# Altium project Proyecto.PrjPCB
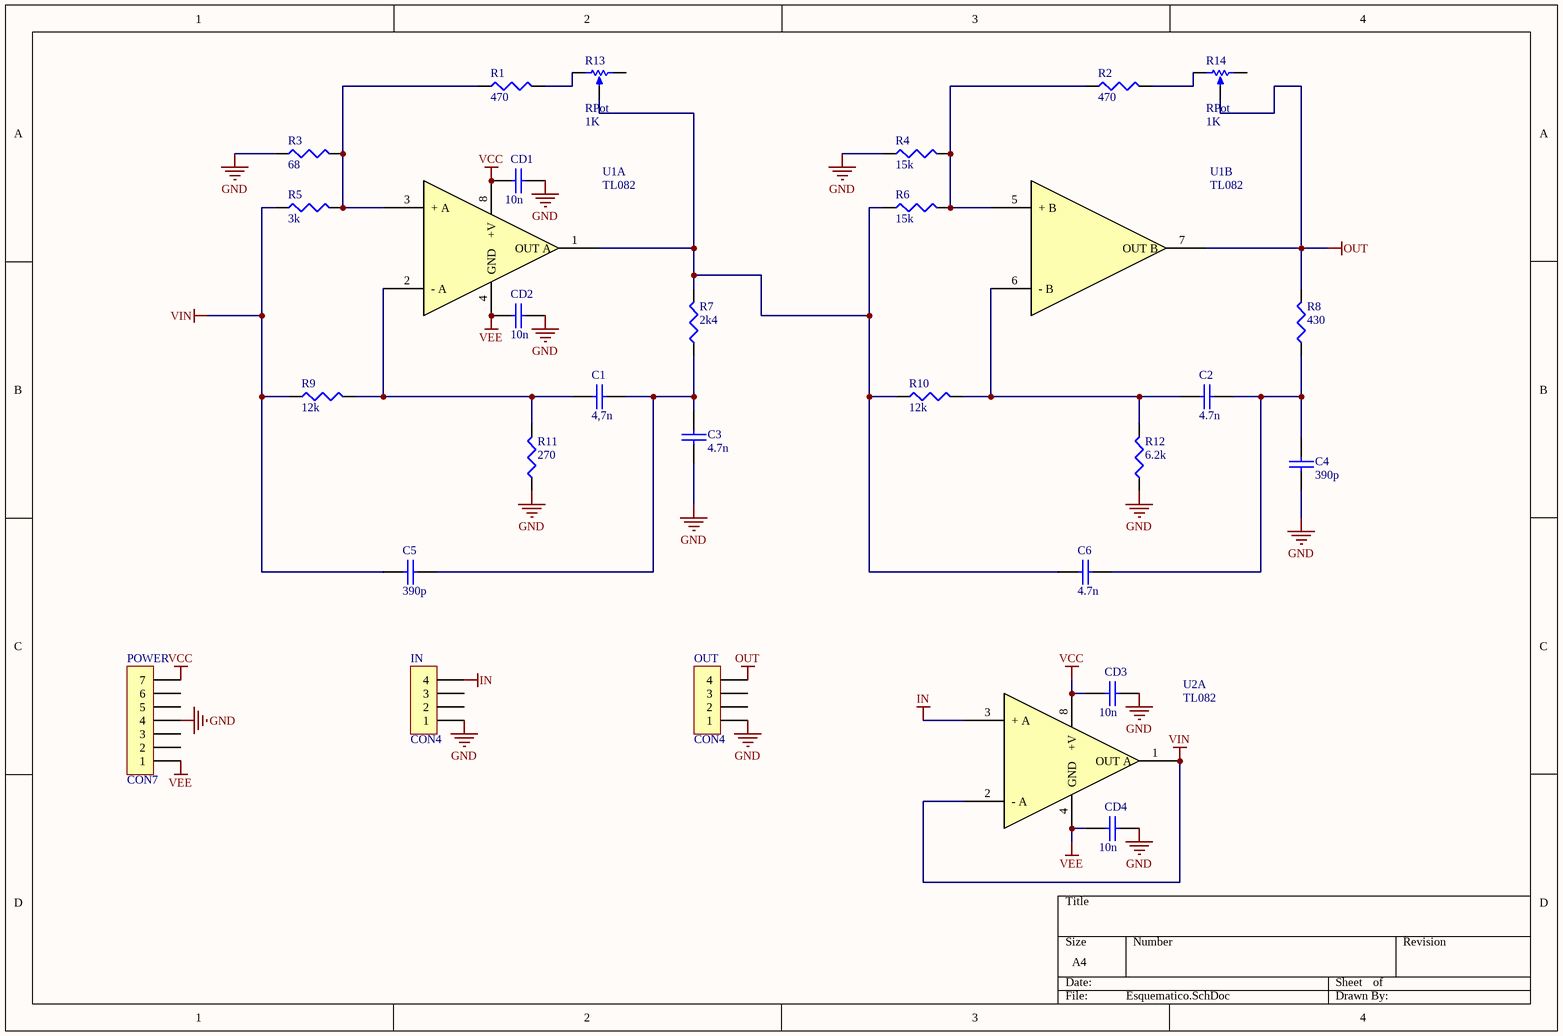
[diagram p0: Esquematico.SchDoc]
1 sheet, 29 parts. Net scope: global (net labels, ports and power ports of the same name join across sheets).
Board file: PCB.PcbDoc

## Sheet Esquematico.SchDoc
size A4

### Parts
C1  4,7n  [CAP200]
C2  4.7n  [CAP200]
C3  4.7n  [CAP200]
C4  390p  [CAP200]
C5  390p  [CAP200]
C6  4.7n  [CAP200]
CD1  10n  [CAP200]
CD2  10n  [CAP200]
CD3  10n  [CAP200]
CD4  10n  [CAP200]
IN  CON4  [SIP4]
OUT  CON4  [SIP4]
POWER  CON7  [SIP7]
R1  470  [J1-0603]
R2  470  [J1-0603]
R3  68  [J1-0603]
R4  15k  [J1-0603]
R5  3k  [J1-0603]
R6  15k  [J1-0603]
R7  2k4  [J1-0603]
R8  430  [J1-0603]
R9  12k  [J1-0603]
R10  12k  [J1-0603]
R11  270  [J1-0603]
R12  6.2k  [J1-0603]
R13  RPot  value 1K  [VR5]
R14  RPot  value 1K  [VR5]
U1  TL082  [DIP8]  (parts A,B of 2)
U2  TL082  [DIP8]  (part A of 2)

### Nets
GND: C3.2 C4.2 CD1.2 CD2.2 CD3.2 CD4.2 IN.1 OUT.1 POWER.4 R3.1 R4.1 R11.1 R12.1
IN: IN.4 U2.3(+_A)
OUT: OUT.4 R8.2 R14.3(TAP) U1.7(OUT_B)
VCC: CD1.1 CD3.1 POWER.7 U1.8(+V) U2.8(+V)
VEE: CD2.1 CD4.1 POWER.1 U1.4(GND) U2.4(GND)
VIN: C5.1 R5.1 R9.1 U2.1(OUT_A) U2.2(-_A)
NetC1_1: C1.1 R9.2 R11.2 U1.2(-_A)
NetC1_2: C1.2 C3.1 C5.2 R7.1
NetC2_1: C2.1 R10.2 R12.2 U1.6(-_B)
NetC2_2: C2.2 C4.1 C6.2 R8.1
NetC6_1: C6.1 R6.1 R7.2 R10.1 R13.3(TAP) U1.1(OUT_A)
NetR1_1: R1.1 R3.2 R5.2 U1.3(+_A)
NetR1_2: R1.2 R13.1(TOP)
NetR2_1: R2.1 R4.2 R6.2 U1.5(+_B)
NetR2_2: R2.2 R14.1(TOP)

Not connected (* = marked no-connect by the designer): IN 2 3; OUT 2 3; POWER 2 3 5 6; R13 2(BOT); R14 2(BOT)

### Library data of the parts
C1-C6 CD1-CD4 = CAP
R1-R12 = Res3: Resistor; Published: 8-Jun-2000; LatestRevisionDate: 29-May-2009; LatestRevisionNote: IPC-7351 Footprint Added.; PackageReference: J1-0603; Publisher: Altium Limited; PackageDescription: Chip Resistor
R13 R14 = RPot: Potentiometer; Sim Note: Enter the Resistance value and the set point into parameter fields.; Set Position: 0.5; Published: 8-Jun-2000; LatestRevisionDate: 17-Jul-2002; LatestRevisionNote: Re-released for DXP Platform.; PackageReference: VR5; Publisher: Altium Limited; PackageDescription: Variable Resistor, Thru-Hole; 3 Leads
U1 U2 = LM833: Dual Audio Operational Amplifier